# EAGLE design blinker_board (EAGLE 9.6.2)
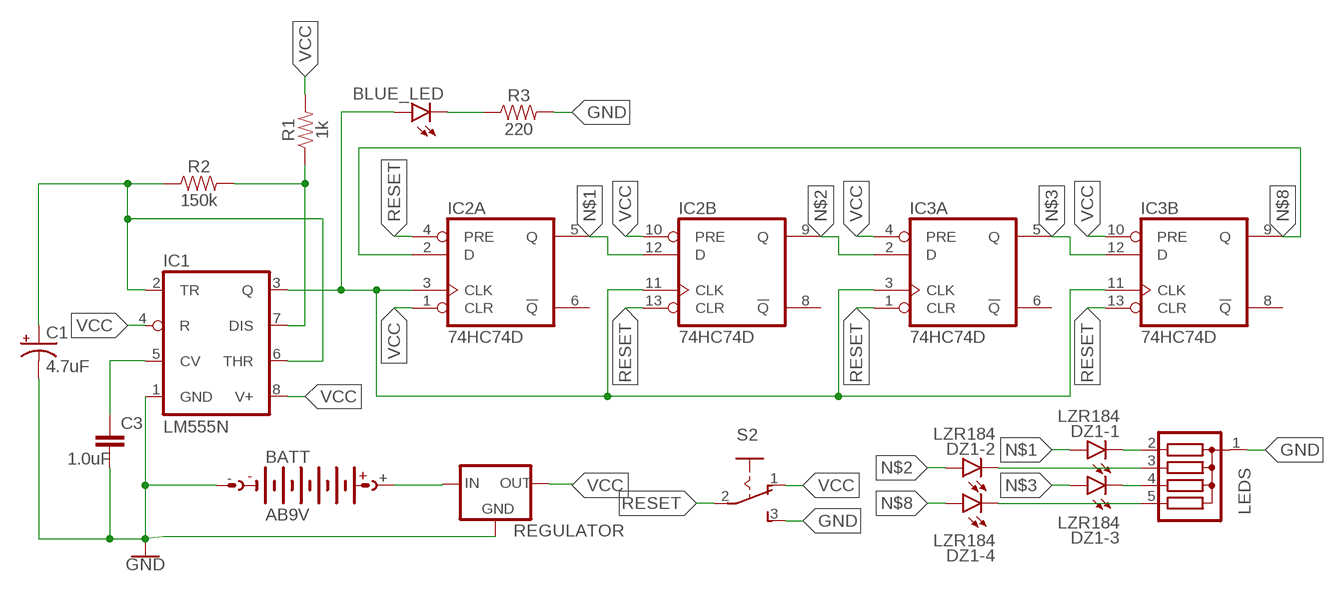
[diagram p0: schematic, sheet 1]

## Parts
BATT  AB9V  [AB9V]
BLUE_LED  LED  [SMARTLED-TTW]
C1  4.7uF  CPOL-USA/3216-18R  [A/3216-18R]
C3  1.0uF  1.0UF-0402-16V-10%  [0402]
DZ1  LZR184  [LZR184]
IC1  LM555N  [DIL08]
IC2  74HC74D  [SO14]
IC3  74HC74D  [SO14]
LEDS  G04R  [SIL5]
R1  1k  1KOHM-0603-1/10W-1%  [0603]
R2  150k  150KOHM-0603-1/10W-1%  [0603]
R3  220  220OHM-0603-1/10W-1%  [0603]
REGULATOR  78MXXS  [78MXXS]
S2  255SB  [255SB]

## Nets
GND: BATT.- C1.- C3.2 IC1.1(GND) LEDS.1 R3.2 REGULATOR.GND S2.3(S)
N$1: DZ1.A1(-1:A) IC2.5(A:Q) IC2.12(B:D)
N$2: DZ1.A2(-2:A) IC2.9(B:Q) IC3.2(A:D)
N$3: DZ1.A3(-3:A) IC3.5(A:Q) IC3.12(B:D)
N$4: BLUE_LED.A@1(A) IC1.3(Q) IC2.3(A:CLK) IC2.11(B:CLK) IC3.3(A:CLK) IC3.11(B:CLK)
N$5: BATT.+ REGULATOR.IN
N$6: DZ1.K1(-1:C) LEDS.2
N$7: DZ1.K2(-2:C) LEDS.3
N$8: DZ1.A4(-4:A) IC2.2(A:D) IC3.9(B:Q)
N$9: DZ1.K3(-3:C) LEDS.4
N$10: DZ1.K4(-4:C) LEDS.5
N$11: C3.1 IC1.5(CV)
N$13: IC1.7(DIS) R1.1 R2.2
N$14: BLUE_LED.C@1(C) R3.1
N$16: C1.+ IC1.2(TR) IC1.6(THR) R2.1
RESET: IC2.4(A:PRE) IC2.13(B:CLR) IC3.1(A:CLR) IC3.13(B:CLR) S2.2(P)
VCC: IC1.4(R) IC1.8(V+) IC2.1(A:CLR) IC2.10(B:PRE) IC3.4(A:PRE) IC3.10(B:PRE) R1.2 REGULATOR.OUT S2.1(O)
Unconnected: IC2.6(A:!Q) IC2.8(B:!Q) IC3.6(A:!Q) IC3.8(B:!Q)

## Power pins joined to a net without a drawn wire
GND: IC2.7(P:GND) IC3.7(P:GND)
VCC: IC2.14(P:VCC) IC3.14(P:VCC)

## Library data of the parts
BATT = battery:AB9V: 9-V BATTERY CLIP
BLUE_LED = led:LED: LED OSRAM: - CHIPLED LG R971, LG N971, LY N971, LG Q971, LY Q971, LO R971, LY R971 LH N974, LH R974 LS Q976, LO Q976, LY Q976 LO Q996 - Hyper CHIPLED LW Q18S LB Q993, LB Q99A, LB R99A - SideLED LS A670, LO A670, LY A670, LG A670, LP A670 LB A673, LV A673, LT A673, LW A673 LH A674 LY A675 LS A676, LA A676, LO A676, LY A676, LW A676 LS A679, LY A679, LG A679 - Hyper Micro SIDELED® LS Y876, LA Y876, LO Y876, LY Y876 LT Y87S - SmartLED LW L88C, LW L88S LB L89C, LB L89S, LG L890 LS L89K, LO L89K, LY L89K LS L896, LA L896, LO L896, LY L896 - TOPLED LS T670, LO T670, LY T670, LG T670, LP T670 LSG T670, LSP T670, LSY T670, LOP T670, LYG T670 LG T671, LOG T671, LSG T671 LB T673, LV T673, LT T673, LW T673 LH T674 LS T676, LA T676, LO T676, LY T676, LB T676, LH T676, LSB T676, LW T676 LB T67C, LV T67C, LT T67C, LS T67K, LO T67K, LY T67K, LW E67C LS E67B, LA E67B, LO E67B, LY E67B, LB E67C, LV E67C, LT E67C LW T67C LS T679, LY T679, LG T679 LS T770, LO T770, LY T770, LG T770, LP T770 LB T773, LV T773, LT T773, LW T773 LH T774 LS E675, LA E675, LY E675, LS T675 LS T776, LA T776, LO T776, LY T776, LB T776 LHGB T686 LT T68C, LB T68C - Hyper Mini TOPLED® LB M676 - Mini TOPLED Santana® LG M470 LS M47K, LO M47K, LY M47K Source: http://www.osram.convergy.de LUXEON: - LUMILED® LXK2-PW12-R00, LXK2-PW12-S00, LXK2-PW14-U00, LXK2-PW14-V00 LXK2-PM12-R00, LXK2-PM12-S00, LXK2-PM14-U00 LXK2-PE12-Q00, LXK2-PE12-R00, LXK2-PE12-S00, LXK2-PE14-T00, LXK2-PE14-U00 LXK2-PB12-K00, LXK2-PB12-L00, LXK2-PB12-M00, LXK2-PB14-N00, LXK2-PB14-P00, LXK2-PB14-Q00 LXK2-PR12-L00, LXK2-PR12-M00, LXK2-PR14-Q00, LXK2-PR14-R00 LXK2-PD12-Q00, LXK2-PD12-R00, LXK2-PD12-S00 LXK2-PH12-R00, LXK2-PH12-S00 LXK2-PL12-P00, LXK2-PL12-Q00, LXK2-PL12-R00 Source: www.luxeon.com KINGBRIGHT: KA-3528ASYC Source: www.kingbright.com
C1 = rcl:CPOL-US: POLARIZED CAPACITOR, American symbol; SPICEPREFIX: C
C3 = SparkFun-Capacitors:1.0UF: 1µF ceramic capacitors A capacitor is a passive two-terminal electrical component used to store electrical energy temporarily in an electric field.; PROD_ID: CAP-12417
DZ1 = led:LZR184: LED BLOCK 4 LEDs, Siemens
IC1 = linear:*555: TIMER
IC2 IC3 = 74xx-eu:74*74: Dual D type positive edge triggered FLIP FLOP, preset and clear
LEDS = resistor-sil:G04R: SIL RESISTOR; OC_FARNELL: unknown; OC_NEWARK: unknown
R1 = SparkFun-Resistors:1KOHM: 1kΩ resistor A resistor is a passive two-terminal electrical component that implements electrical resistance as a circuit element. Resistors act to reduce current flow, and, at the same time, act to lower voltage levels within circuits. - Wikipedia; PROD_ID: RES-07856
R2 = SparkFun-Resistors:150KOHM: 150kΩ resistor A resistor is a passive two-terminal electrical component that implements electrical resistance as a circuit element. Resistors act to reduce current flow, and, at the same time, act to lower voltage levels within circuits. - Wikipedia; PROD_ID: RES-09117
R3 = SparkFun-Resistors:220OHM: 220Ω resistor A resistor is a passive two-terminal electrical component that implements electrical resistance as a circuit element. Resistors act to reduce current flow, and, at the same time, act to lower voltage levels within circuits. - Wikipedia; PROD_ID: RES-07861
REGULATOR = v-reg:78MXXS: VOLTAGE REGULATOR
S2 = switch:255SB: SLIDING SWITCH Distributor Buerklin, 11G810

## Board
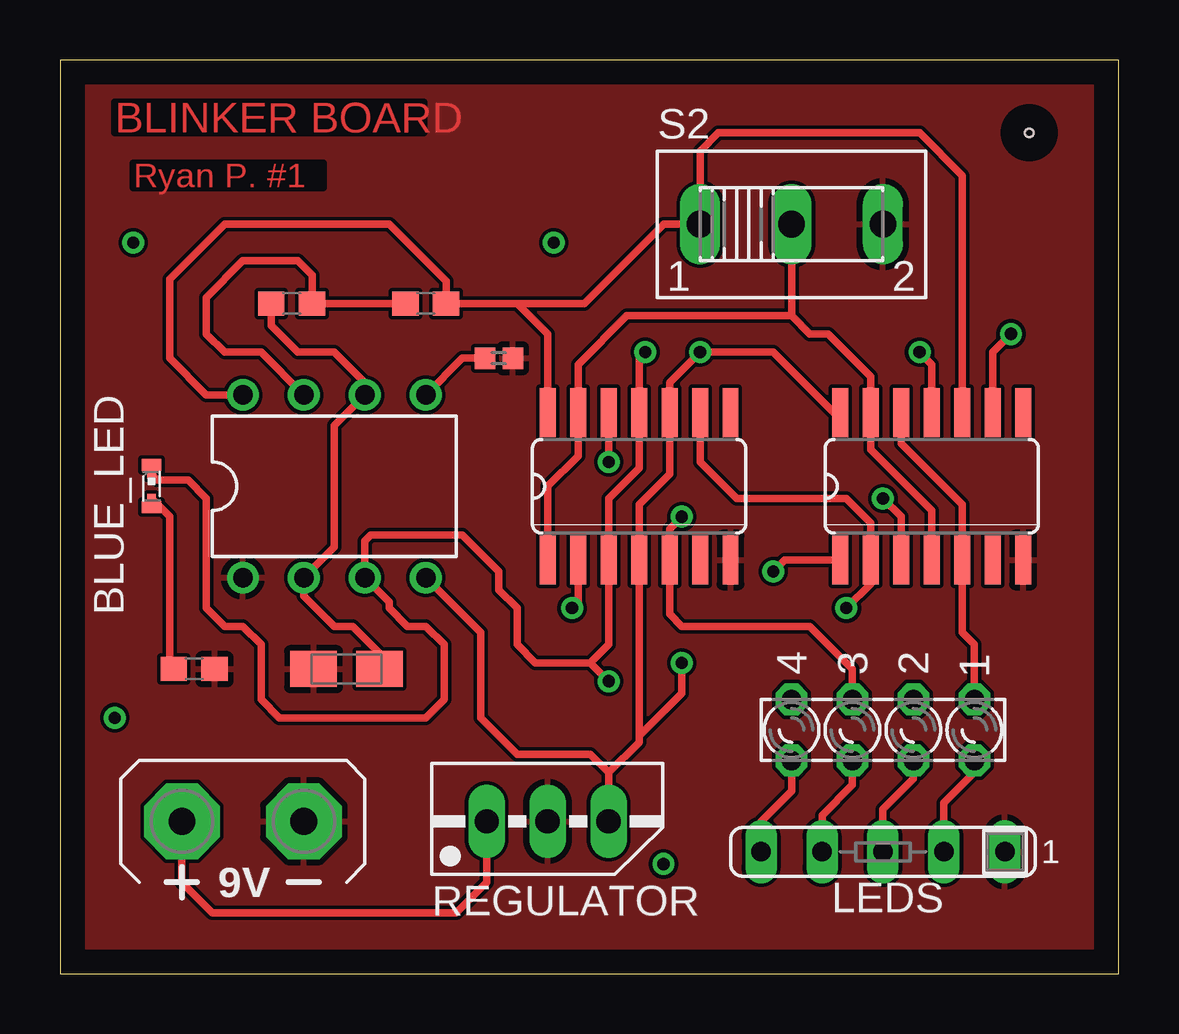
[diagram p1: board, top side]
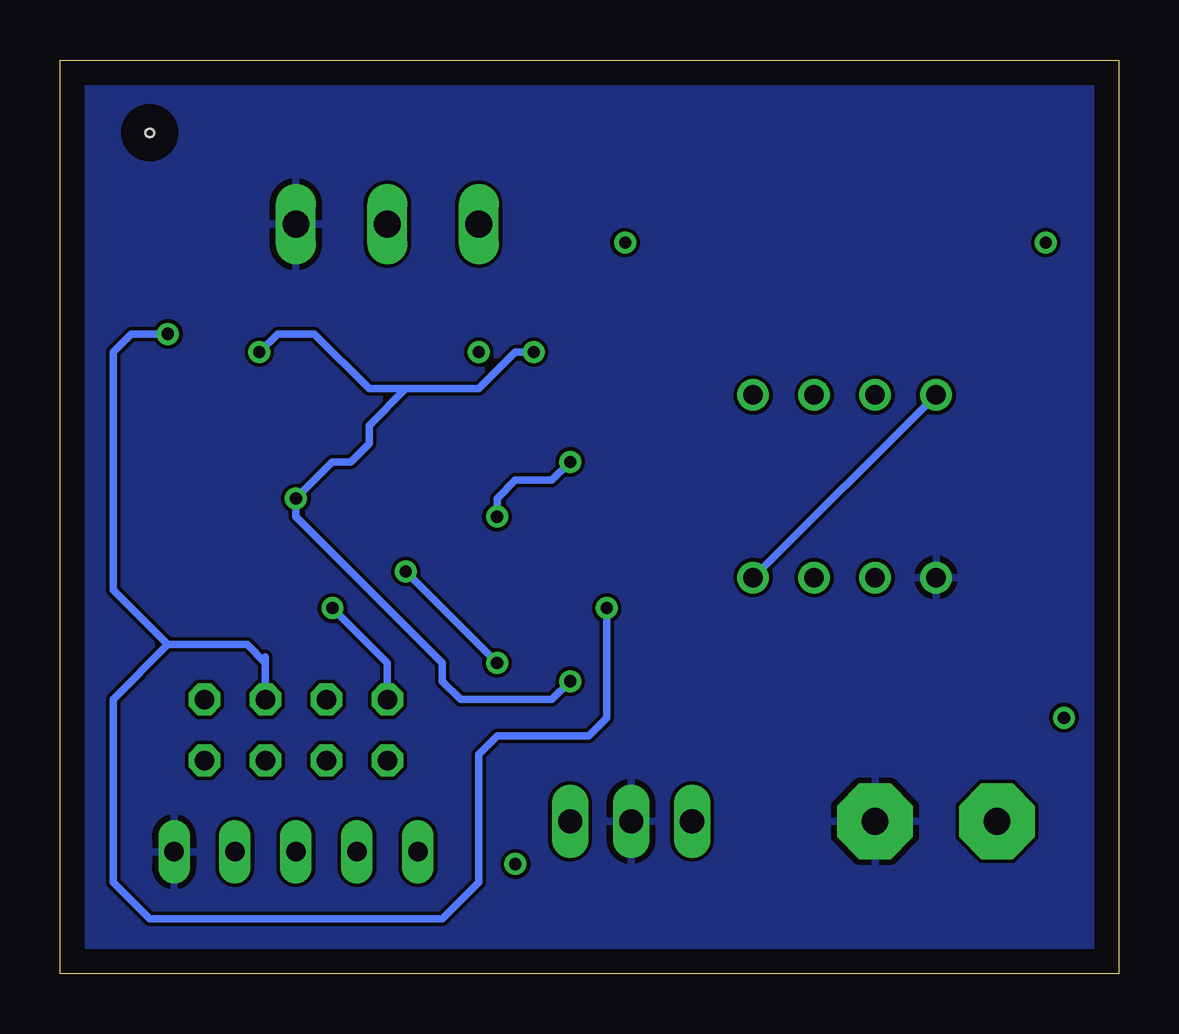
[diagram p2: board, bottom side, seen from below]

Size 44.12 x 38.09 mm. Coordinates in mm from the lower left corner, seen from the top.
Outline: 0,0 44.12,0 44.12,38.09 0,38.09 0,0
Copper layers (1*16): Top 0.035mm / dielectric 1.5mm / Bottom 0.035mm
Design rules "default": minimum track width 6mil, minimum drill 0.35mm, track to track 6mil, track to pad 6mil, pad to pad 6mil, via to via 6mil, smd to smd 6mil, copper to edge 40mil, drill to drill 6mil, minimum pad ring 10mil, minimum via ring 8mil, stop-mask expansion 4mil, vias tented up to drill 0mil, thermal gap 10mil
Holes 0.35 mm at 40.39,35.05

### Footprints (pad centres in the part's own frame; a part is rotated, then mirrored left to right if it is on the bottom)
AB9V = drill 1.118 pad 3.15 octagon: + 0,2.54; - 0,-2.54
SMARTLED-TTW = smd 0.8 x 0.5: A 0,-0.875; C 0,0.875 | smd 0.35 x 0.35: A@1 0,-0.5; C@1 0,0.5
A/3216-18R = smd 1.95 x 1.5: + 1.375,0; - -1.375,0
0402 = smd 0.85 x 0.9: 1 -0.58,0; 2 0.58,0
LZR184 = drill 0.813 octagon: A1 -1.27,3.81; A2 -1.27,1.27; A3 -1.27,-1.27; A4 -1.27,-3.81; K1 1.27,3.81; K2 1.27,1.27; K3 1.27,-1.27; K4 1.27,-3.81
DIL08 = drill 0.813 pad 1.27: 1 -3.81,-3.81; 2 -1.27,-3.81; 3 1.27,-3.81; 4 3.81,-3.81; 5 3.81,3.81; 6 1.27,3.81; 7 -1.27,3.81; 8 -3.81,3.81
SO14 = smd 0.66 x 2.032: 1 -3.81,-3.073; 2 -2.54,-3.073; 3 -1.27,-3.073; 4 0,-3.073; 5 1.27,-3.073; 6 2.54,-3.073; 7 3.81,-3.073; 8 3.81,3.073; 9 2.54,3.073; 10 1.27,3.073; 11 0,3.073; 12 -1.27,3.073; 13 -2.54,3.073; 14 -3.81,3.073
SIL5 = drill 0.813 long: 1 -5.08,0; 2 -2.54,0; 3 0,0; 4 2.54,0; 5 5.08,0
0603 = smd 1.1 x 1: 1 -0.85,0; 2 0.85,0
78MXXS = drill 1.016 long: GND 0,-2.54; IN -2.54,-2.54; OUT 2.54,-2.54
255SB = drill 1.118 long: 1 -3.81,0; 2 0,0; 3 3.81,0

### Placement (x,y rotation side)
BATT  7.62,6.35 90 top
BLUE_LED  3.81,20.32 180 top
C1  11.94,12.7 0 top
C3  18.29,25.65 0 top
DZ1  34.29,10.16 270 top
IC1  11.43,20.32 0 top
IC2  36.32,20.32 0 top
IC3  24.13,20.32 0 top
LEDS  34.29,5.08 180 top
R1  15.24,27.94 0 top
R2  9.65,27.94 0 top
R3  5.59,12.7 0 top
REGULATOR  20.32,8.89 0 top
S2  30.48,31.24 0 top

### Tracks (layer width: path | path; a pad name or v marks a point on that pad's centre or on a via)
GND
  pour Top: 0,38.1 44.45,38.1 44.45,-1.27 0,-1.27
  pour Bottom: 0.76,37.34 43.43,37.34 43.43,0.76 0.76,0.76
N$1
  Top 0.305: DZ1.A1 38.1,13.72 37.59,14.22 IC2.5 37.59,19.56 35.05,22.1 IC2.12
N$2  (via drill 0.51)
  Top 0.305: IC3.2 21.59,15.49 v21.34,15.24 | v39.62,26.67 38.86,25.91 IC2.9
  Bottom 0.305: 39.62,13.72 41.91,16 41.91,25.91 41.15,26.67 v39.62,26.67 | 35.56,13.21 35.56,12.95 | 35.56,12.95 DZ1.A2 | 35.56,12.95 36.32,13.72 39.62,13.72 | 39.62,13.72 41.91,11.43 41.91,3.81 40.39,2.29 28.19,2.29 26.67,3.81 26.67,9.14 25.91,9.91 22.1,9.91 21.34,10.67 v21.34,15.24
N$3  (via drill 0.51)
  Top 0.305: DZ1.A3 33.02,12.7 31.24,14.48 25.91,14.48 25.4,14.99 IC3.5 25.4,18.54 v25.91,19.05 | v22.86,21.34 IC3.12
  Bottom 0.305: v25.91,19.05 25.91,19.81 25.15,20.57 23.62,20.57 v22.86,21.34
N$4  (via drill 0.51)
  Top 0.305: 22.86,17.53 22.86,19.81 24.13,21.08 IC3.11 24.13,25.65 v24.38,25.91 | IC3.3 22.86,13.72 22.1,12.95 | IC2.3 35.05,19.05 v34.29,19.81 | v35.81,25.91 36.32,25.4 IC2.11 | 22.1,12.95 19.81,12.95 19.05,13.72 19.05,15.24 18.29,16 18.29,16.76 16.76,18.29 12.95,18.29 12.7,18.03 IC1.3 13.72,15.49 13.72,15.24 14.48,14.48 15.24,14.48 16,13.72 16,11.43 15.24,10.67 9.14,10.67 8.38,11.43 8.38,13.72 7.62,14.48 6.86,14.48 6.1,15.24 6.1,19.81 5.33,20.57 4.57,20.57 4.06,20.57 BLUE_LED.A@1 | 22.1,12.95 v22.86,12.19
  Bottom 0.305: v24.38,25.91 25.15,25.91 26.67,24.38 29.72,24.38 | 29.72,24.38 31.24,24.38 33.53,26.67 35.05,26.67 v35.81,25.91 | 29.72,24.38 31.24,22.86 31.24,22.1 32,21.34 32.77,21.34 v34.29,19.81 34.29,19.05 28.19,12.95 28.19,12.19 27.43,11.43 23.62,11.43 v22.86,12.19
N$5
  Top 0.305: BATT.+ 5.08,3.81 6.35,2.54 16.51,2.54 17.78,3.81 REGULATOR.IN
N$6
  Top 0.305: DZ1.K1 38.1,8.38 36.83,7.11 LEDS.2
N$7
  Top 0.305: DZ1.K2 35.56,8.13 34.29,6.86 LEDS.3
N$8  (via drill 0.51)
  Top 0.305: IC3.9 26.67,21.34 28.19,19.81 32.77,19.81 33.78,18.8 33.78,17.53 IC2.2 33.78,16.26 v32.77,15.24
  Bottom 0.305: DZ1.A4 30.48,12.95 v32.77,15.24
N$9
  Top 0.305: DZ1.K3 33.02,7.87 31.75,6.6 LEDS.4
N$10
  Top 0.305: DZ1.K4 30.48,7.62 29.21,6.35 LEDS.5
N$11
  Top 0.305: IC1.5 16.76,25.65 C3.1
N$12  (via drill 0.51)
  other vias: 3.05,30.48
N$13
  Top 0.305: R1.1 R2.2 10.5,29.12 9.91,29.72 7.62,29.72 6.1,28.19 6.1,26.67 6.86,25.91 8.38,25.91 IC1.7
N$14
  Top 0.305: BLUE_LED.C@1 4.57,19.06 4.57,12.87 R3.1
N$15  (via drill 0.51)
  other vias: 20.57,30.48
N$16
  Top 0.305: R2.1 8.8,27.01 9.91,25.91 11.43,25.91 12.7,24.64 IC1.6 11.43,22.86 11.43,17.78 IC1.2 10.16,15.75 11.43,14.48 12.19,14.48 13.31,13.36 C1.+
N$17  (via drill 0.51)
  other vias: 2.29,10.67
N$18  (via drill 0.51)
  other vias: 25.15,4.57
RESET
  Top 0.305: S2.2 30.48,27.43 | 30.48,27.43 31.24,26.67 32,26.67 33.78,24.89 IC2.13 33.78,21.84 36.32,19.3 IC2.4 | 30.48,27.43 23.62,27.43 21.59,25.4 IC3.13 21.59,21.59 20.32,20.32 IC3.1
VCC  (via drill 0.51)
  Top 0.305: 19.05,27.94 R1.2 16.09,28.87 13.72,31.24 6.86,31.24 4.57,28.96 4.57,25.65 6.1,24.13 IC1.8 | 19.05,27.94 21.84,27.94 25.15,31.24 S2.1 26.67,34.29 27.43,35.05 35.81,35.05 37.59,33.27 IC2.10 | 22.86,8.38 22.1,9.14 19.05,9.14 17.53,10.67 17.53,14.22 IC1.4 | 24.13,9.91 24.13,9.65 22.86,8.38 | 24.13,9.91 IC3.4 24.13,19.56 25.4,20.83 IC3.10 25.4,24.64 v26.67,25.91 29.72,25.91 32.23,23.39 IC2.14 | 24.13,9.91 25.91,11.68 v25.91,12.95 | v29.72,16.76 30.2,17.25 IC2.1 | IC3.14 20.32,26.67 19.05,27.94 | REGULATOR.OUT 22.86,8.38
  Bottom 0.305: v29.72,16.76 v25.91,12.95 | IC1.8 IC1.4

### Text on the board
Top: BLINKER BOARD | Ryan P. #1